# Altium schematic sheet Connections.SchDoc
size A4
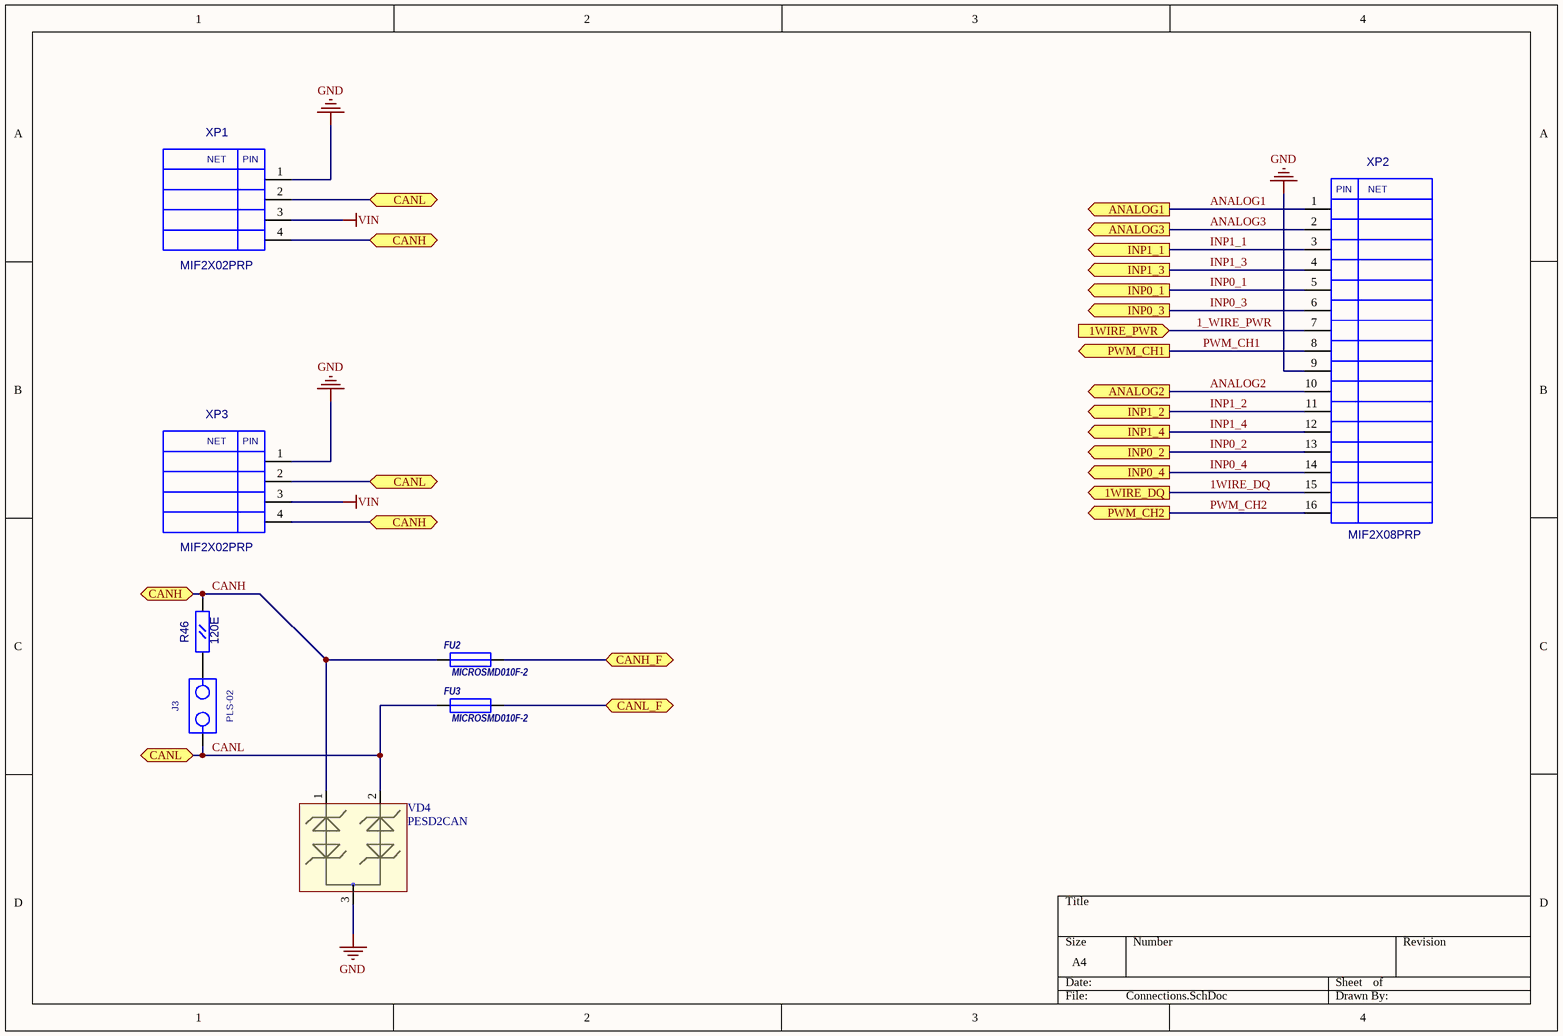
[diagram p0: Connections.SchDoc]

## Parts
FU2  MICROSMD010F-2  [RC1210]
FU3  MICROSMD010F-2  [RC1210]
J3  PLS-02  [PLS-02]
R46  120E  [RC0805]
VD4  PESD2CAN  [SOT-23(123)]
XP1  MIF2X02PRP  [MIF2X02PRP]
XP2  MIF2X08PRP  [MIF2X08PRP]
XP3  MIF2X02PRP  [MIF2X02PRP]

## Ports
1WIRE_DQ (out), 1WIRE_PWR (in), ANALOG1 (out), ANALOG2 (out), ANALOG3 (out), CANH, CANH (bidir), CANH_F, CANL, CANL (bidir), CANL_F, INP0_1 (out), INP0_2 (out), INP0_3 (out), INP0_4 (out), INP1_1 (out), INP1_2 (out), INP1_3 (out), INP1_4 (out), PWM_CH1 (out), PWM_CH2 (out)

## Nets
GND: VD4.3 XP1.1 XP2.9 XP3.1
VIN: XP1.3 XP3.3
1_WIRE_PWR: XP2.7 ; port 1WIRE_PWR
1WIRE_DQ: XP2.15 ; port 1WIRE_DQ
ANALOG1: XP2.1 ; port ANALOG1
ANALOG2: XP2.10 ; port ANALOG2
ANALOG3: XP2.2 ; port ANALOG3
CANH: FU2.1 R46.2(B) VD4.1 XP1.4 XP3.4 ; port CANH
CANH_F: FU2.2 ; port CANH_F
CANL: FU3.1 J3.1 VD4.2 XP1.2 XP3.2 ; port CANL
CANL_F: FU3.2 ; port CANL_F
INP0_1: XP2.5 ; port INP0_1
INP0_2: XP2.13 ; port INP0_2
INP0_3: XP2.6 ; port INP0_3
INP0_4: XP2.14 ; port INP0_4
INP1_1: XP2.3 ; port INP1_1
INP1_2: XP2.11 ; port INP1_2
INP1_3: XP2.4 ; port INP1_3
INP1_4: XP2.12 ; port INP1_4
PWM_CH1: XP2.8 ; port PWM_CH1
PWM_CH2: XP2.16 ; port PWM_CH2
NetJ3_2: J3.2 R46.1(A)

## Notes on the sheet
- (in symbol MIF2X02PRP) NET; PIN
- (in symbol MIF2X08PRP) PIN; NET

## Library data of the parts
FU2 FU3 = MICROSMD: Value: MICROSMD010F-2
R46 = RC0805: Value: 120E
VD4 = PESD2CAN: TVS for CAN
J3 = PLS-02: Value: *
XP1 XP3 = MIF2X02PRP: Value: *
XP2 = MIF2X08PRP: Value: *